# Altium schematic sheet SAMA7G54_PIO.SchDoc
size 420 x 297 mm; SheetNumber: 11; SheetTotal: 32
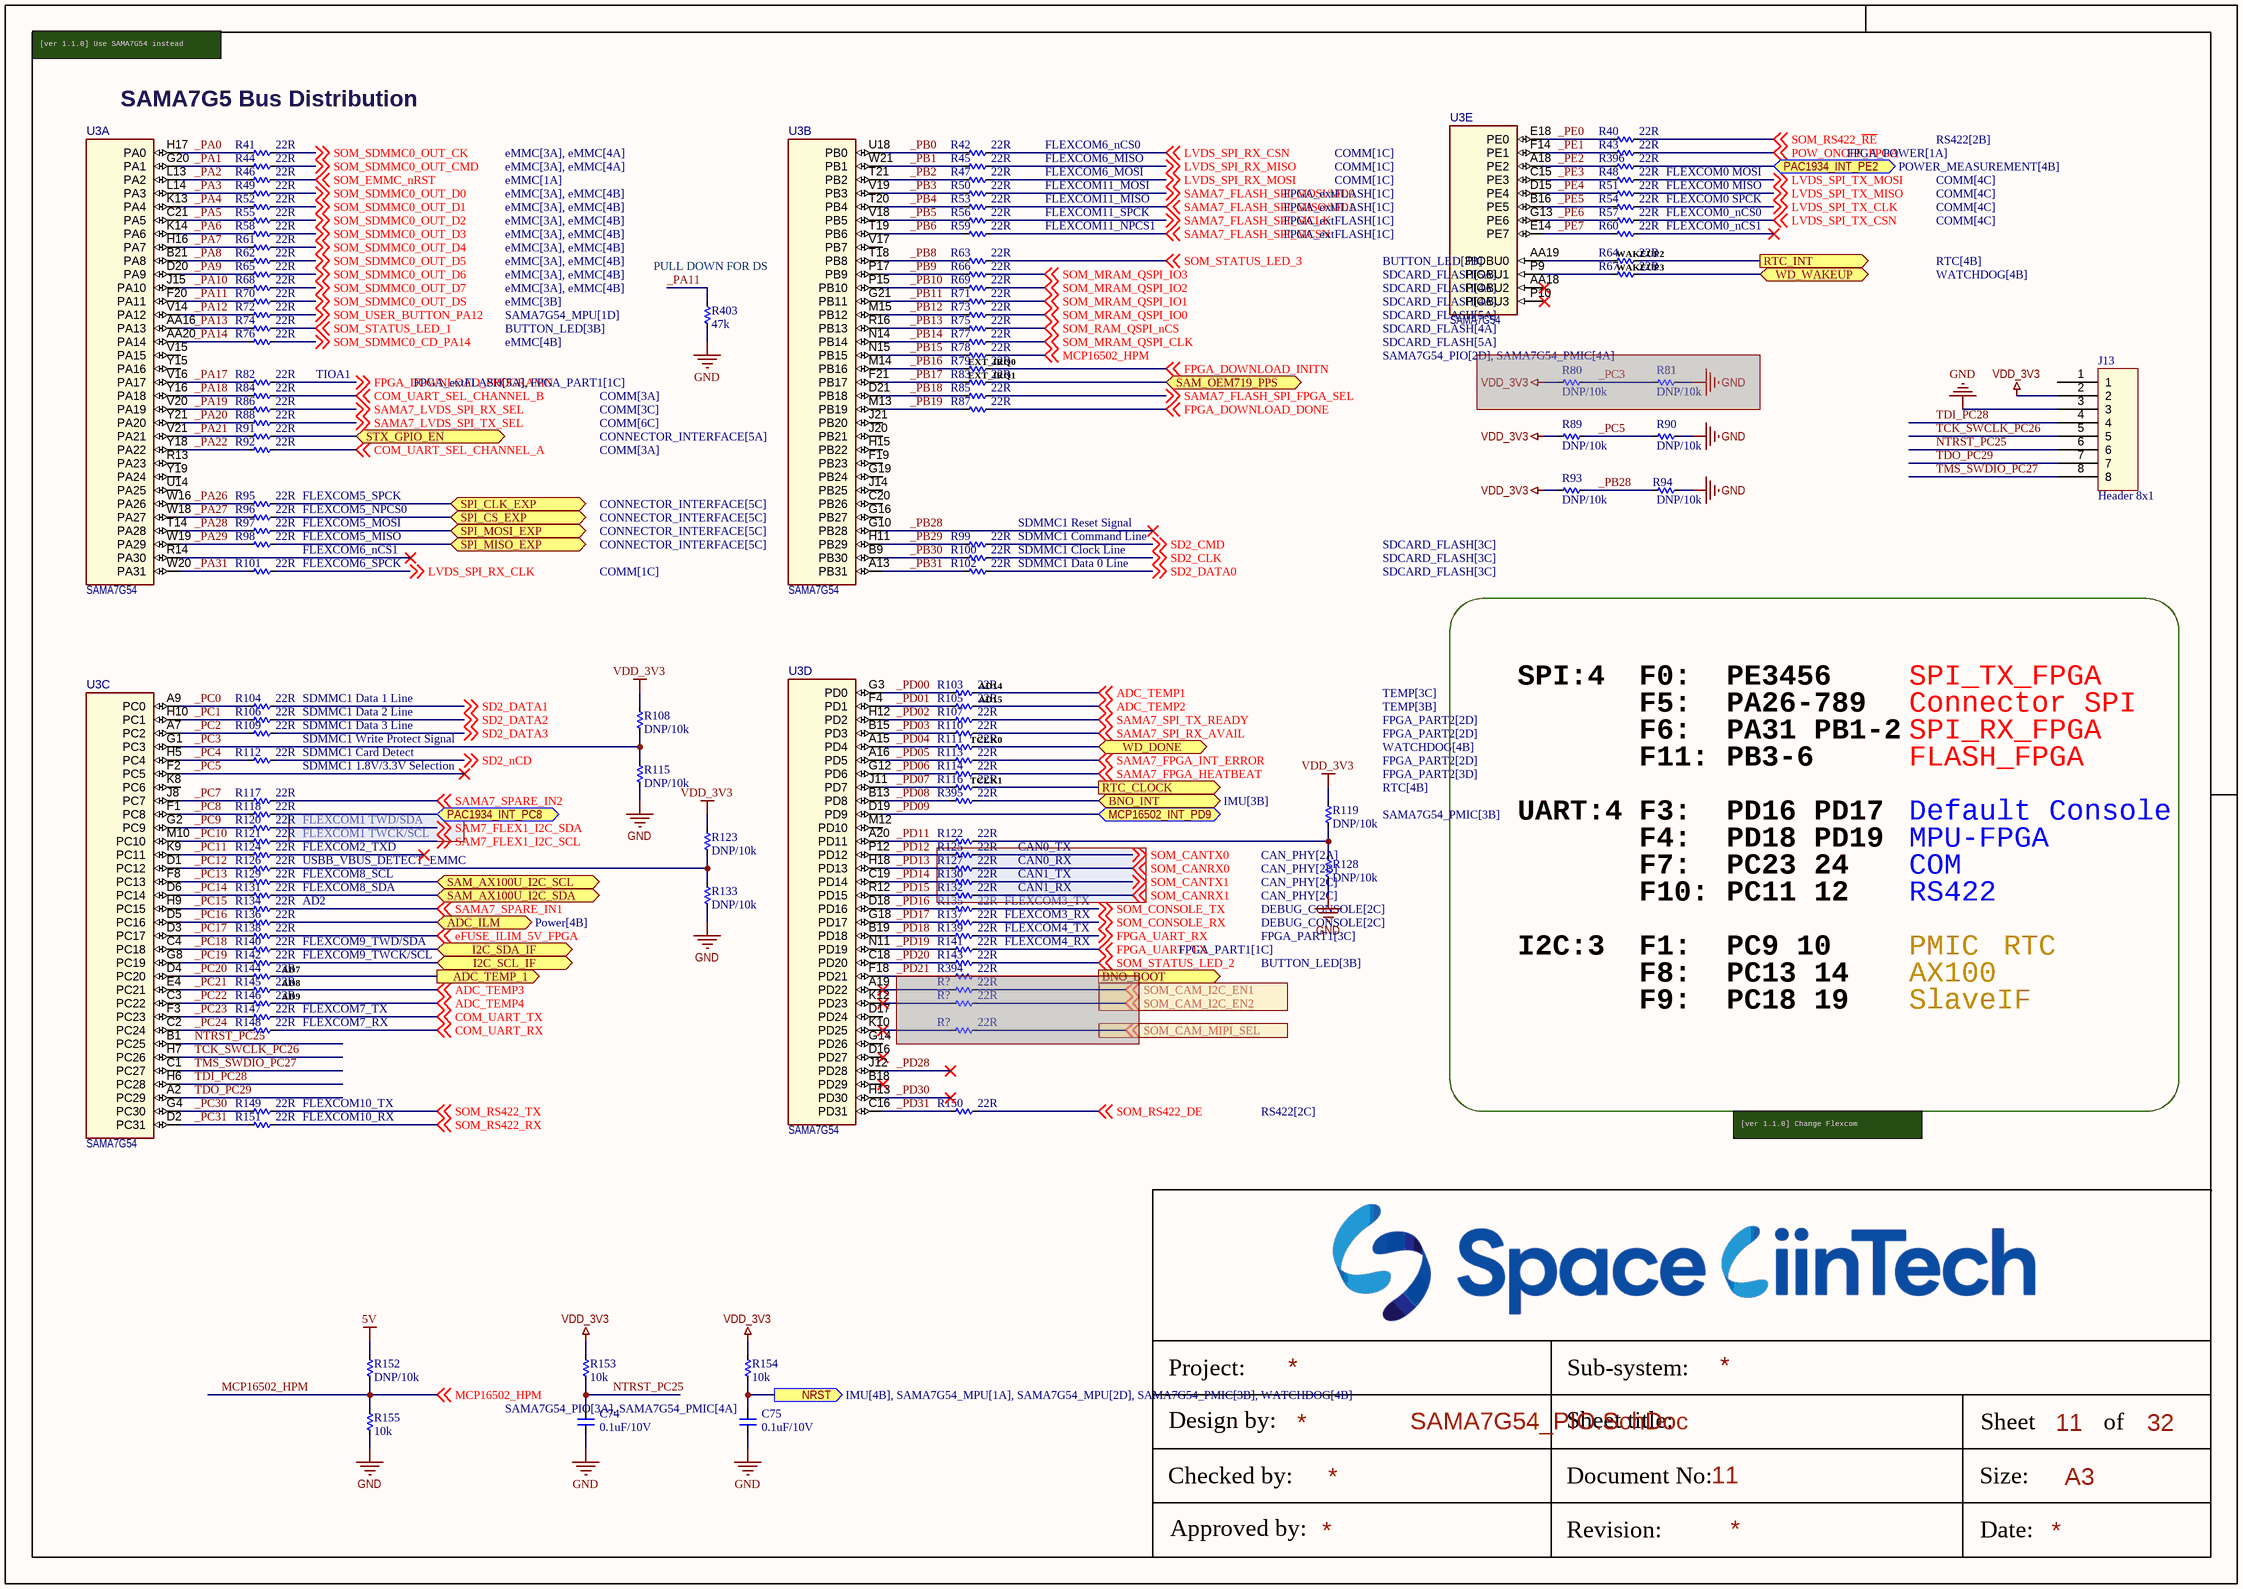
[diagram p0: SAMA7G54_PIO.SchDoc]

## Parts
(Parts that share a designator on the sheet are numbered #1, #2 ... from top to bottom, then left to right.)
C74  0.1uF/10V  [CAP_C_1005X50_L]
C75  0.1uF/10V  [CAP_C_1005X50_L]
J13  Header 8x1  [PAD JTAG 1.27]
R40  22R  [RES_C_1005x30_L]
R41  22R  [RES_C_1005x30_L]
R42  22R  [RES_C_1005x30_L]
R43  22R  [RES_C_1005x30_L]
R44  22R  [RES_C_1005x30_L]
R45  22R  [RES_C_1005x30_L]
R46  22R  [RES_C_1005x30_L]
R47  22R  [RES_C_1005x30_L]
R48  22R  [RES_C_1005x30_L]
R49  22R  [RES_C_1005x30_L]
R50  22R  [RES_C_1005x30_L]
R51  22R  [RES_C_1005x30_L]
R52  22R  [RES_C_1005x30_L]
R53  22R  [RES_C_1005x30_L]
R54  22R  [RES_C_1005x30_L]
R55  22R  [RES_C_1005x30_L]
R56  22R  [RES_C_1005x30_L]
R57  22R  [RES_C_1005x30_L]
R58  22R  [RES_C_1005x30_L]
R59  22R  [RES_C_1005x30_L]
R60  22R  [RES_C_1005x30_L]
R61  22R  [RES_C_1005x30_L]
R62  22R  [RES_C_1005x30_L]
R63  22R  [RES_C_1005x30_L]
R64  22R  [RES_C_1005x30_L]
R65  22R  [RES_C_1005x30_L]
R66  22R  [RES_C_1005x30_L]
R67  22R  [RES_C_1005x30_L]
R68  22R  [RES_C_1005x30_L]
R69  22R  [RES_C_1005x30_L]
R70  22R  [RES_C_1005x30_L]
R71  22R  [RES_C_1005x30_L]
R72  22R  [RES_C_1005x30_L]
R73  22R  [RES_C_1005x30_L]
R74  22R  [RES_C_1005x30_L]
R75  22R  [RES_C_1005x30_L]
R76  22R  [RES_C_1005x30_L]
R77  22R  [RES_C_1005x30_L]
R78  22R  [RES_C_1005x30_L]
R79  22R  [RES_C_1005x30_L]
R80  DNP/10k  [RES_C_1005x30_L]  (masked out: inside a compile mask, not in the netlist)
R81  DNP/10k  [RES_C_1005x30_L]  (masked out: inside a compile mask, not in the netlist)
R82  22R  [RES_C_1005x30_L]
R83  22R  [RES_C_1005x30_L]
R84  22R  [RES_C_1005x30_L]
R85  22R  [RES_C_1005x30_L]
R86  22R  [RES_C_1005x30_L]
R87  22R  [RES_C_1005x30_L]
R88  22R  [RES_C_1005x30_L]
R89  DNP/10k  [RES_C_1005x30_L]
R90  DNP/10k  [RES_C_1005x30_L]
R91  22R  [RES_C_1005x30_L]
R92  22R  [RES_C_1005x30_L]
R93  DNP/10k  [RES_C_1005x30_L]
R94  DNP/10k  [RES_C_1005x30_L]
R95  22R  [RES_C_1005x30_L]
R96  22R  [RES_C_1005x30_L]
R97  22R  [RES_C_1005x30_L]
R98  22R  [RES_C_1005x30_L]
R99  22R  [RES_C_1005x30_L]
R100  22R  [RES_C_1005x30_L]
R101  22R  [RES_C_1005x30_L]
R102  22R  [RES_C_1005x30_L]
R103  22R  [RES_C_1005x30_L]
R104  22R  [RES_C_1005x30_L]
R105  22R  [RES_C_1005x30_L]
R106  22R  [RES_C_1005x30_L]
R107  22R  [RES_C_1005x30_L]
R108  DNP/10k  [RES_C_1005x30_L]
R109  22R  [RES_C_1005x30_L]
R110  22R  [RES_C_1005x30_L]
R111  22R  [RES_C_1005x30_L]
R112  22R  [RES_C_1005x30_L]
R113  22R  [RES_C_1005x30_L]
R114  22R  [RES_C_1005x30_L]
R115  DNP/10k  [RES_C_1005x30_L]
R116  22R  [RES_C_1005x30_L]
R117  22R  [RES_C_1005x30_L]
R118  22R  [RES_C_1005x30_L]
R119  DNP/10k  [RES_C_1005x30_L]
R120  22R  [RES_C_1005x30_L]
R121  22R  [RES_C_1005x30_L]
R122  22R  [RES_C_1005x30_L]
R123  DNP/10k  [RES_C_1005x30_L]
R124  22R  [RES_C_1005x30_L]
R125  22R  [RES_C_1005x30_L]
R126  22R  [RES_C_1005x30_L]
R127  22R  [RES_C_1005x30_L]
R128  DNP/10k  [RES_C_1005x30_L]
R129  22R  [RES_C_1005x30_L]
R130  22R  [RES_C_1005x30_L]
R131  22R  [RES_C_1005x30_L]
R132  22R  [RES_C_1005x30_L]
R133  DNP/10k  [RES_C_1005x30_L]
R134  22R  [RES_C_1005x30_L]
R135  22R  [RES_C_1005x30_L]
R136  22R  [RES_C_1005x30_L]
R137  22R  [RES_C_1005x30_L]
R138  22R  [RES_C_1005x30_L]
R139  22R  [RES_C_1005x30_L]
R140  22R  [RES_C_1005x30_L]
R141  22R  [RES_C_1005x30_L]
R142  22R  [RES_C_1005x30_L]
R143  22R  [RES_C_1005x30_L]
R144  22R  [RES_C_1005x30_L]
R145  22R  [RES_C_1005x30_L]
R146  22R  [RES_C_1005x30_L]
R147  22R  [RES_C_1005x30_L]
R148  22R  [RES_C_1005x30_L]
R149  22R  [RES_C_1005x30_L]
R150  22R  [RES_C_1005x30_L]
R151  22R  [RES_C_1005x30_L]
R152  DNP/10k  [RES_C_1005x30_L]
R153  10k  [RES_C_1005x30_L]
R154  10k  [RES_C_1005x30_L]
R155  10k  [RES_C_1005x30_L]
R394  22R  [RES_C_1005x30_L]  (masked out: inside a compile mask, not in the netlist)
R395  22R  [RES_C_1005x30_L]
R396  22R  [RES_C_1005x30_L]
R403  47k  [RES_C_1005x30_L]
R?#1  22R  [RES_C_1005x30_L]  (masked out: inside a compile mask, not in the netlist)
R?#2  22R  [RES_C_1005x30_L]  (masked out: inside a compile mask, not in the netlist)
R?#3  22R  [RES_C_1005x30_L]  (masked out: inside a compile mask, not in the netlist)
U3  SAMA7G54  [TFBGA-343_14x14 - 2.5mm]  (parts A,B,C,D,E of 8)

## Ports
ADC_ILM (bidir, see Power[4B]), ADC_TEMP_1 (out, see TEMP[4A]), BNO_BOOT (out, see IMU[2B]), BNO_INT (bidir, see IMU[3B]), I2C_SCL_IF (bidir, see CONNECTOR_INTERFACE[3C], CONNECTOR_INTERFACE[5B]), I2C_SDA_IF (bidir, see CONNECTOR_INTERFACE[3C], CONNECTOR_INTERFACE[5B]), MCP16502_INT_PD9 (bidir, see SAMA7G54_PMIC[3B]), NRST (out, see IMU[4B], SAMA7G54_MPU[1A], SAMA7G54_MPU[2D], SAMA7G54_PMIC[3B], WATCHDOG[4B]), PAC1934_INT_PC8 (bidir, see SAMA7G54_PMIC[2B]), PAC1934_INT_PE2 (bidir, see POWER_MEASUREMENT[4B]), RTC_CLOCK (out, see RTC[4B]), RTC_INT (out, see RTC[4B]), SAM_AX100U_I2C_SCL (bidir, see CONNECTOR_INTERFACE[3B]), SAM_AX100U_I2C_SDA (bidir, see CONNECTOR_INTERFACE[6B]), SAM_OEM719_PPS (bidir, see CONNECTOR_INTERFACE[1D], CONNECTOR_INTERFACE[5A]), SPI_CLK_EXP (bidir, see CONNECTOR_INTERFACE[5C]), SPI_CS_EXP (bidir, see CONNECTOR_INTERFACE[5C]), SPI_MISO_EXP (bidir, see CONNECTOR_INTERFACE[5C]), SPI_MOSI_EXP (bidir, see CONNECTOR_INTERFACE[5C]), STX_GPIO_EN (bidir, see CONNECTOR_INTERFACE[5A]), WD_DONE (bidir, see WATCHDOG[4B]), WD_WAKEUP (bidir, see WATCHDOG[4B])

## Nets
5V: R152.1
GND: C74.1 C75.1 J13.3 R90.1 R94.1 R115.2 R128.2 R133.2 R155.2 R403.2
VDD_3V3: J13.2 R89.2 R93.2 R108.1 R119.1 R123.1 R153.2 R154.2
_PA0: R41.2 U3.H17(PA0)
_PA1: R44.2 U3.G20(PA1)
_PA2: R46.2 U3.L13(PA2)
_PA3: R49.2 U3.L14(PA3)
_PA4: R52.2 U3.K13(PA4)
_PA5: R55.2 U3.C21(PA5)
_PA6: R58.2 U3.K14(PA6)
_PA7: R61.2 U3.H16(PA7)
_PA8: R62.2 U3.B21(PA8)
_PA9: R65.2 U3.D20(PA9)
_PA10: R68.2 U3.J15(PA10)
_PA11: R70.2 R403.1 U3.F20(PA11)
_PA12: R72.2 U3.V14(PA12)
_PA13: R74.2 U3.AA16(PA13)
_PA14: R76.2 U3.AA20(PA14)
_PA17: R82.2 U3.V16(PA17)
_PA18: R84.2 U3.Y16(PA18)
_PA19: R86.2 U3.V20(PA19)
_PA20: R88.2 U3.Y21(PA20)
_PA21: R91.2 U3.V21(PA21)
_PA22: R92.2 U3.Y18(PA22)
_PA26: R95.2 U3.W16(PA26)
_PA27: R96.2 U3.W18(PA27)
_PA28: R97.2 U3.T14(PA28)
_PA29: R98.2 U3.W19(PA29)
_PA31: R101.2 U3.W20(PA31)
_PB0: R42.2 U3.U18(PB0)
_PB1: R45.2 U3.W21(PB1)
_PB2: R47.2 U3.T21(PB2)
_PB3: R50.2 U3.V19(PB3)
_PB4: R53.2 U3.T20(PB4)
_PB5: R56.2 U3.V18(PB5)
_PB6: R59.2 U3.T19(PB6)
_PB8: R63.2 U3.T18(PB8)
_PB9: R66.2 U3.P17(PB9)
_PB10: R69.2 U3.P15(PB10)
_PB11: R71.2 U3.G21(PB11)
_PB12: R73.2 U3.M15(PB12)
_PB13: R75.2 U3.R16(PB13)
_PB14: R77.2 U3.N14(PB14)
_PB15: R78.2 U3.N15(PB15)
_PB16: R79.2 U3.M14(PB16)
_PB17: R83.2 U3.F21(PB17)
_PB18: R85.2 U3.D21(PB18)
_PB19: R87.2 U3.M13(PB19)
_PB28: R93.1 R94.2 U3.G10(PB28)
_PB29: R99.2 U3.H11(PB29)
_PB30: R100.2 U3.B9(PB30)
_PB31: R102.2 U3.A13(PB31)
_PC0: R104.2 U3.A9(PC0)
_PC1: R106.2 U3.H10(PC1)
_PC2: R109.2 U3.A7(PC2)
_PC3: R108.2 R115.1 U3.G1(PC3)
_PC4: R112.2 U3.H5(PC4)
_PC5: R89.1 R90.2 U3.F2(PC5)
_PC7: R117.2 U3.J8(PC7)
_PC8: R118.2 U3.F1(PC8)
_PC9: R120.2 U3.G2(PC9)
_PC10: R121.2 U3.M10(PC10)
_PC11: R124.2 U3.K9(PC11)
_PC12: R126.2 U3.D1(PC12)
_PC13: R129.2 U3.F8(PC13)
_PC14: R131.2 U3.D6(PC14)
_PC15: R134.2 U3.H9(PC15)
_PC16: R136.2 U3.D5(PC16)
_PC17: R138.2 U3.D3(PC17)
_PC18: R140.2 U3.C4(PC18)
_PC19: R142.2 U3.G8(PC19)
_PC20: R144.2 U3.D4(PC20)
_PC21: R145.2 U3.E4(PC21)
_PC22: R146.2 U3.C3(PC22)
_PC23: R147.2 U3.F3(PC23)
_PC24: R148.2 U3.C2(PC24)
_PC30: R149.2 U3.G4(PC30)
_PC31: R151.2 U3.D2(PC31)
_PD00: R103.2 U3.G3(PD0)
_PD01: R105.2 U3.F4(PD1)
_PD02: R107.2 U3.H12(PD2)
_PD03: R110.2 U3.B15(PD3)
_PD04: R111.2 U3.A15(PD4)
_PD05: R113.2 U3.A16(PD5)
_PD06: R114.2 U3.G12(PD6)
_PD07: R116.2 U3.J11(PD7)
_PD08: R395.2 U3.B13(PD8)
_PD09: U3.D19(PD9) ; port MCP16502_INT_PD9
_PD11: R122.2 U3.A20(PD11)
_PD12: R125.2 U3.P12(PD12)
_PD13: R127.2 U3.H18(PD13)
_PD14: R130.2 U3.C19(PD14)
_PD15: R132.2 U3.R12(PD15)
_PD16: R135.2 U3.D18(PD16)
_PD17: R137.2 U3.G18(PD17)
_PD18: R139.2 U3.B19(PD18)
_PD19: R141.2 U3.N11(PD19)
_PD20: R143.2 U3.C18(PD20)
_PD28: U3.J12(PD28)
_PD30: U3.H13(PD30)
_PD31: R150.2 U3.C16(PD31)
_PE0: R40.2 U3.E18(PE0)
_PE1: R43.2 U3.F14(PE1)
_PE2: R396.2 U3.A18(PE2)
_PE3: R48.2 U3.C15(PE3)
_PE4: R51.2 U3.D15(PE4)
_PE5: R54.2 U3.B16(PE5)
_PE6: R57.2 U3.G13(PE6)
_PE7: R60.2 U3.E14(PE7)
ADC_ILM: R136.1 ; port ADC_ILM
ADC_TEMP1: R103.1 ; off-sheet ADC_TEMP1
ADC_TEMP2: R105.1 ; off-sheet ADC_TEMP2
ADC_TEMP3: R145.1 ; off-sheet ADC_TEMP3
ADC_TEMP4: R146.1 ; off-sheet ADC_TEMP4
ADC_TEMP_1: R144.1 ; port ADC_TEMP_1
BNO_INT: R395.1 ; port BNO_INT
COM_UART_RX: R148.1 ; off-sheet COM_UART_RX
COM_UART_SEL_CHANNEL_A: R92.1 ; off-sheet COM_UART_SEL_CHANNEL_A
COM_UART_SEL_CHANNEL_B: R84.1 ; off-sheet COM_UART_SEL_CHANNEL_B
COM_UART_TX: R147.1 ; off-sheet COM_UART_TX
eFUSE_ILIM_5V_FPGA: R138.1 ; off-sheet eFUSE_ILIM_5V_FPGA
FPGA_DOWNLOAD_DONE: R87.1 ; off-sheet FPGA_DOWNLOAD_DONE
FPGA_DOWNLOAD_INITN: R79.1 ; off-sheet FPGA_DOWNLOAD_INITN
FPGA_DOWNLOAD_PROGRAMN: R82.1 ; off-sheet FPGA_DOWNLOAD_PROGRAMN
FPGA_UART_RX: R139.1 ; off-sheet FPGA_UART_RX
FPGA_UART_TX: R141.1 ; off-sheet FPGA_UART_TX
I2C_SCL_IF: R142.1 ; port I2C_SCL_IF
I2C_SDA_IF: R140.1 ; port I2C_SDA_IF
LVDS_SPI_RX_CLK: R101.1 ; off-sheet LVDS_SPI_RX_CLK
LVDS_SPI_RX_CSN: R42.1 ; off-sheet LVDS_SPI_RX_CSN
LVDS_SPI_RX_MISO: R45.1 ; off-sheet LVDS_SPI_RX_MISO
LVDS_SPI_RX_MOSI: R47.1 ; off-sheet LVDS_SPI_RX_MOSI
LVDS_SPI_TX_CLK: R54.1 ; off-sheet LVDS_SPI_TX_CLK
LVDS_SPI_TX_CSN: R57.1 ; off-sheet LVDS_SPI_TX_CSN
LVDS_SPI_TX_MISO: R51.1 ; off-sheet LVDS_SPI_TX_MISO
LVDS_SPI_TX_MOSI: R48.1 ; off-sheet LVDS_SPI_TX_MOSI
MCP16502_HPM: R78.1 R152.2 R155.1 ; off-sheet MCP16502_HPM
NRST: C75.2 R154.1 ; port NRST
NTRST_PC25: C74.2 J13.6 R153.1 U3.B1(PC25)
PAC1934_INT_PC8: R118.1 ; port PAC1934_INT_PC8
PAC1934_INT_PE2: R396.1 ; port PAC1934_INT_PE2
POW_ONOFF_FPGA: R43.1 ; off-sheet POW_ONOFF_FPGA
RTC_CLOCK: R116.1 ; port RTC_CLOCK
RTC_INT: R64.1 ; port RTC_INT
SAM7_FLEX1_I2C_SCL: R121.1 ; off-sheet SAM7_FLEX1_I2C_SCL
SAM7_FLEX1_I2C_SDA: R120.1 ; off-sheet SAM7_FLEX1_I2C_SDA
SAM_AX100U_I2C_SCL: R129.1 ; port SAM_AX100U_I2C_SCL
SAM_AX100U_I2C_SDA: R131.1 ; port SAM_AX100U_I2C_SDA
SAM_OEM719_PPS: R83.1 ; port SAM_OEM719_PPS
SAMA7_FLASH_SPI_FPGA_SEL: R85.1 ; off-sheet SAMA7_FLASH_SPI_FPGA_SEL
SAMA7_FLASH_SPI_MCLK: R56.1 ; off-sheet SAMA7_FLASH_SPI_MCLK
SAMA7_FLASH_SPI_MCSN: R59.1 ; off-sheet SAMA7_FLASH_SPI_MCSN
SAMA7_FLASH_SPI_MISO/MD1: R53.1 ; off-sheet SAMA7_FLASH_SPI_MISO/MD1
SAMA7_FLASH_SPI_MOSI/MD0: R50.1 ; off-sheet SAMA7_FLASH_SPI_MOSI/MD0
SAMA7_FPGA_HEATBEAT: R114.1 ; off-sheet SAMA7_FPGA_HEATBEAT
SAMA7_FPGA_INT_ERROR: R113.1 ; off-sheet SAMA7_FPGA_INT_ERROR
SAMA7_LVDS_SPI_RX_SEL: R86.1 ; off-sheet SAMA7_LVDS_SPI_RX_SEL
SAMA7_LVDS_SPI_TX_SEL: R88.1 ; off-sheet SAMA7_LVDS_SPI_TX_SEL
SAMA7_SPARE_IN1: R134.1 ; off-sheet SAMA7_SPARE_IN1
SAMA7_SPARE_IN2: R117.1 ; off-sheet SAMA7_SPARE_IN2
SAMA7_SPI_RX_AVAIL: R110.1 ; off-sheet SAMA7_SPI_RX_AVAIL
SAMA7_SPI_TX_READY: R107.1 ; off-sheet SAMA7_SPI_TX_READY
SD2_CLK: R100.1 ; off-sheet SD2_CLK
SD2_CMD: R99.1 ; off-sheet SD2_CMD
SD2_DATA0: R102.1 ; off-sheet SD2_DATA0
SD2_DATA1: R104.1 ; off-sheet SD2_DATA1
SD2_DATA2: R106.1 ; off-sheet SD2_DATA2
SD2_DATA3: R109.1 ; off-sheet SD2_DATA3
SD2_nCD: R112.1 ; off-sheet SD2_nCD
SOM_CANRX0: R127.1 ; off-sheet SOM_CANRX0
SOM_CANRX1: R132.1 ; off-sheet SOM_CANRX1
SOM_CANTX0: R125.1 ; off-sheet SOM_CANTX0
SOM_CANTX1: R130.1 ; off-sheet SOM_CANTX1
SOM_CONSOLE_RX: R137.1 ; off-sheet SOM_CONSOLE_RX
SOM_CONSOLE_TX: R135.1 ; off-sheet SOM_CONSOLE_TX
SOM_EMMC_nRST: R46.1 ; off-sheet SOM_EMMC_nRST
SOM_MRAM_QSPI_CLK: R77.1 ; off-sheet SOM_MRAM_QSPI_CLK
SOM_MRAM_QSPI_IO0: R73.1 ; off-sheet SOM_MRAM_QSPI_IO0
SOM_MRAM_QSPI_IO1: R71.1 ; off-sheet SOM_MRAM_QSPI_IO1
SOM_MRAM_QSPI_IO2: R69.1 ; off-sheet SOM_MRAM_QSPI_IO2
SOM_MRAM_QSPI_IO3: R66.1 ; off-sheet SOM_MRAM_QSPI_IO3
SOM_RAM_QSPI_nCS: R75.1 ; off-sheet SOM_RAM_QSPI_nCS
SOM_RS422_DE: R150.1 ; off-sheet SOM_RS422_DE
SOM_RS422_~{RE}: R40.1 ; off-sheet SOM_RS422_~{RE}
SOM_RS422_RX: R151.1 ; off-sheet SOM_RS422_RX
SOM_RS422_TX: R149.1 ; off-sheet SOM_RS422_TX
SOM_SDMMC0_CD_PA14: R76.1 ; off-sheet SOM_SDMMC0_CD_PA14
SOM_SDMMC0_OUT_CK: R41.1 ; off-sheet SOM_SDMMC0_OUT_CK
SOM_SDMMC0_OUT_CMD: R44.1 ; off-sheet SOM_SDMMC0_OUT_CMD
SOM_SDMMC0_OUT_D0: R49.1 ; off-sheet SOM_SDMMC0_OUT_D0
SOM_SDMMC0_OUT_D1: R52.1 ; off-sheet SOM_SDMMC0_OUT_D1
SOM_SDMMC0_OUT_D2: R55.1 ; off-sheet SOM_SDMMC0_OUT_D2
SOM_SDMMC0_OUT_D3: R58.1 ; off-sheet SOM_SDMMC0_OUT_D3
SOM_SDMMC0_OUT_D4: R61.1 ; off-sheet SOM_SDMMC0_OUT_D4
SOM_SDMMC0_OUT_D5: R62.1 ; off-sheet SOM_SDMMC0_OUT_D5
SOM_SDMMC0_OUT_D6: R65.1 ; off-sheet SOM_SDMMC0_OUT_D6
SOM_SDMMC0_OUT_D7: R68.1 ; off-sheet SOM_SDMMC0_OUT_D7
SOM_SDMMC0_OUT_DS: R70.1 ; off-sheet SOM_SDMMC0_OUT_DS
SOM_STATUS_LED_1: R74.1 ; off-sheet SOM_STATUS_LED_1
SOM_STATUS_LED_2: R143.1 ; off-sheet SOM_STATUS_LED_2
SOM_STATUS_LED_3: R63.1 ; off-sheet SOM_STATUS_LED_3
SOM_USER_BUTTON_PA12: R72.1 ; off-sheet SOM_USER_BUTTON_PA12
SPI_CLK_EXP: R95.1 ; port SPI_CLK_EXP
SPI_CS_EXP: R96.1 ; port SPI_CS_EXP
SPI_MISO_EXP: R98.1 ; port SPI_MISO_EXP
SPI_MOSI_EXP: R97.1 ; port SPI_MOSI_EXP
STX_GPIO_EN: R91.1 ; port STX_GPIO_EN
TCK_SWCLK_PC26: J13.5 U3.H7(PC26)
TDI_PC28: J13.4 U3.H6(PC28)
TDO_PC29: J13.7 U3.A2(PC29)
TMS_SWDIO_PC27: J13.8 U3.C1(PC27)
WD_DONE: R111.1 ; port WD_DONE
WD_WAKEUP: R67.1 ; port WD_WAKEUP
NetR64_2: R64.2 U3.AA19(PIOBU0)
NetR67_2: R67.2 U3.P9(PIOBU1)
NetR119_2: R119.2 R122.1 R128.1
NetR123_2: R123.2 R126.1 R133.1

Not connected (* = marked no-connect by the designer): J13 1; R60 1*; R124 1*; U3 A19(PD22)* AA18(PIOBU2)* B18(PD29)* C20(PB26) D16(PD27)* D17(PD24) F18(PD21) F19(PB23) G14(PD26) G16(PB27) G19(PB24) H15(PB22) J14(PB25) J20(PB21) J21(PB20) K8(PC6) K10(PD25)* K12(PD23)* M12(PD10) P10(PIOBU3)* R13(PA23) R14(PA30)* U14(PA25) V15(PA15) V17(PB7) Y15(PA16) Y19(PA24)

## Notes on the sheet
- [ver 1.1.0] Use SAMA7G54 instead
- SAMA7G5 Bus Distribution
- FLEXCOM6_MOSI
- FLEXCOM6_MISO
- FLEXCOM6_nCS0
- FLEXCOM11_MOSI
- FLEXCOM0 MISO
- FLEXCOM0 MOSI
- FLEXCOM11_SPCK
- FLEXCOM11_NPCS1
- FLEXCOM11_MISO
- FLEXCOM0_nCS0
- FLEXCOM0 SPCK
- FLEXCOM0_nCS1
- WAKEUP2
- (near R403) PULL DOWN FOR DS
- WAKEUP3
- TIOA1
- EXT_IRQ1
- EXT_IRQ0
- FLEXCOM5_SPCK
- FLEXCOM5_NPCS0
- FLEXCOM5_MOSI
- SDMMC1 Reset Signal
- FLEXCOM6_SPCK
- FLEXCOM6_nCS1
- FLEXCOM5_MISO
- SDMMC1 Command Line
- SDMMC1 Data 0 Line
- SDMMC1 Clock Line
- SDMMC1 Data 1 Line
- SDMMC1 Data 2 Line
- SDMMC1 Data 3 Line
- AD14
- AD15
- SPI:4
- F0:  PE3456
- F5:  PA26-789
- SPI_TX_FPGA
- Connector SPI
- SDMMC1 Write Protect Signal
- SDMMC1 Card Detect
- SDMMC1 1.8V/3.3V Selection
- TCLK1
- TCLK0
- F6:  PA31 PB1-2
- F11: PB3-6
- SPI_RX_FPGA
- FLASH_FPGA
- FLEXCOM1 TWD/SDA
- FLEXCOM1 TWCK/SCL
- FLEXCOM2_TXD
- USBB_VBUS_DETECT_EMMC
- CAN0_TX
- CAN0_RX
- UART:4
- F4:  PD18 PD19
- F3:  PD16 PD17
- MPU-FPGA
- Default Console
- AD2
- FLEXCOM8_SCL
- FLEXCOM8_SDA
- FLEXCOM3_RX
- FLEXCOM3_TX
- FLEXCOM4_TX
- CAN1_TX
- CAN1_RX
- F10: PC11 12
- F7:  PC23 24
- RS422
- COM
- FLEXCOM9_TWD/SDA
- FLEXCOM9_TWCK/SCL
- AD7
- AD8
- AD9
- FLEXCOM4_RX
- I2C:3
- F1:  PC9 10
- F8:  PC13 14
- PMIC
- AX100
- RTC
- FLEXCOM7_TX
- FLEXCOM7_RX
- F9:  PC18 19
- SlaveIF
- FLEXCOM10_TX
- FLEXCOM10_RX
- [ver 1.1.0] Change Flexcom
- Project:
- Sub-system:
- Design by:
- Sheet title:
- Sheet
- A3
- of
- Checked by:
- Approved by:
- Revision:
- Document No:
- Size:
- Date:

## Library data of the parts
C74 C75 = _CAP_C_2: CAP
R40-R155 R394-R396 R403 R?#1-R?#3 = _RES_B_2: RES
U3 = SAMA7G54: SAMA7G54 MPU 1000MHz Cortex-A7 TFBGA-343; Manufacturer Part Number 1: SAMA7G54-V/4HB; Manufacturer 1: Microchip; Description_: MCHP MPU 32-BIT Cortex-A7 1000MHz 128kB SAMA7G54-V/4HB TFBGA-343; Populated: YES; MCHP-ID: MIC8923; Symbol: SAMA7G54 TFBGA-343; Dev Tools Status: Design; Owner: Ciprian Abramov; Package: TFBGA-343; Value: SAMA7G54; Type: 32-Bit MPU; Status: MCL Design; Revision: 1; Category: MCHP-Microcontroller; ComponentLink1Description: SVN Datasheet; ComponentLink2Description: Local Datasheet; ComponentLink3URL: C:\ALTIUM_WORK\00001_MCHP-CDB\Library\LibraryRefs\SAMA7G54 TFBGA-343.SchLib; ComponentLink3Description: Open Symbol; ComponentLink4URL: C:\ALTIUM_WORK\00001_MCHP-CDB\Library\Footprints\TFBGA-343_14x14.PcbLib; ComponentLink4Description: Open Footprint; ComponentLink5Description: Open Footprint 2; ComponentLink6Description: Open Footprint 3; ComponentLink7Description: Open Footprint 4; Supplier 1: Microchip; Supplier Part Number 1: SAMA7G54-V/4HB; Quantity Override: 1